# Altium project main_io.PrjPcb (part 1 of 6)
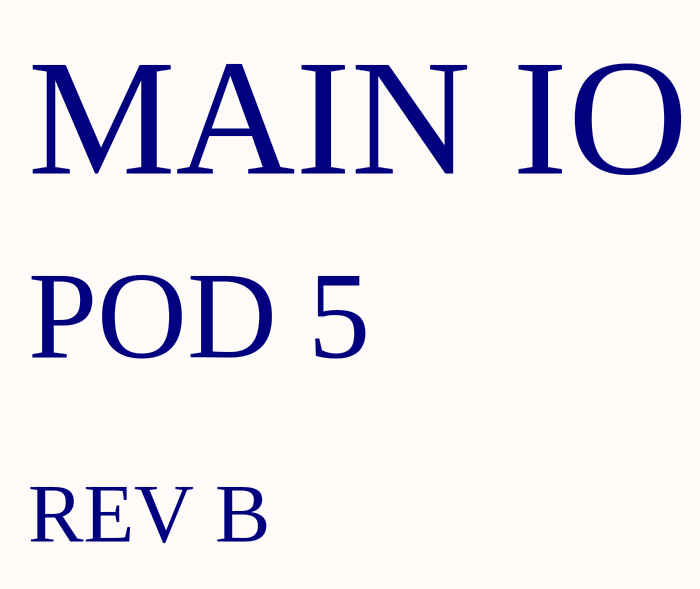
[diagram p0: main_io.SchDoc]
20 sheets, 549 parts. Net scope: global (net labels, ports and power ports of the same name join across sheets).
Board file: main_io.PcbDoc
Sheets:
  main_io.SchDoc
  connectors.SchDoc
  beaglebone.SchDoc
  bus_filter.SchDoc
  power_5V.SchDoc
  power_12V.SchDoc
  can_uart.SchDoc
  retros.SchDoc
  arduino_shield.SchDoc
  bms_interface.SchDoc
  motor_controller_interface.SchDoc
  RTC.SchDoc
  shutdown_circuit.SchDoc
  adc.SchDoc
  battery_interface.SchDoc
  misc_sensors.SchDoc
  batt_protection.SchDoc
  gpio.SchDoc
  limit_switches.SchDoc
  power_28V.SchDoc

## Sheet main_io.SchDoc: Main IO
size A4; Organization: Badgerloop Electrical; Address1: 133 Engineering Research Building; Address2: 1500 Engineering Drive; Address3: Madison, Wi 53706; SheetNumber: 1

### Notes on the sheet
- MAIN IO
- POD 5
- REV B
- Title
- Engineer:
- Date:
- Time:
- Revision:
- Sheet
- of
- File:

## Sheet connectors.SchDoc: Connectors
size A4; Organization: Badgerloop Electrical; Address1: 133 Engineering Research Building; Address2: 1500 Engineering Drive; Address3: Madison, Wi 53706; SheetNumber: 2
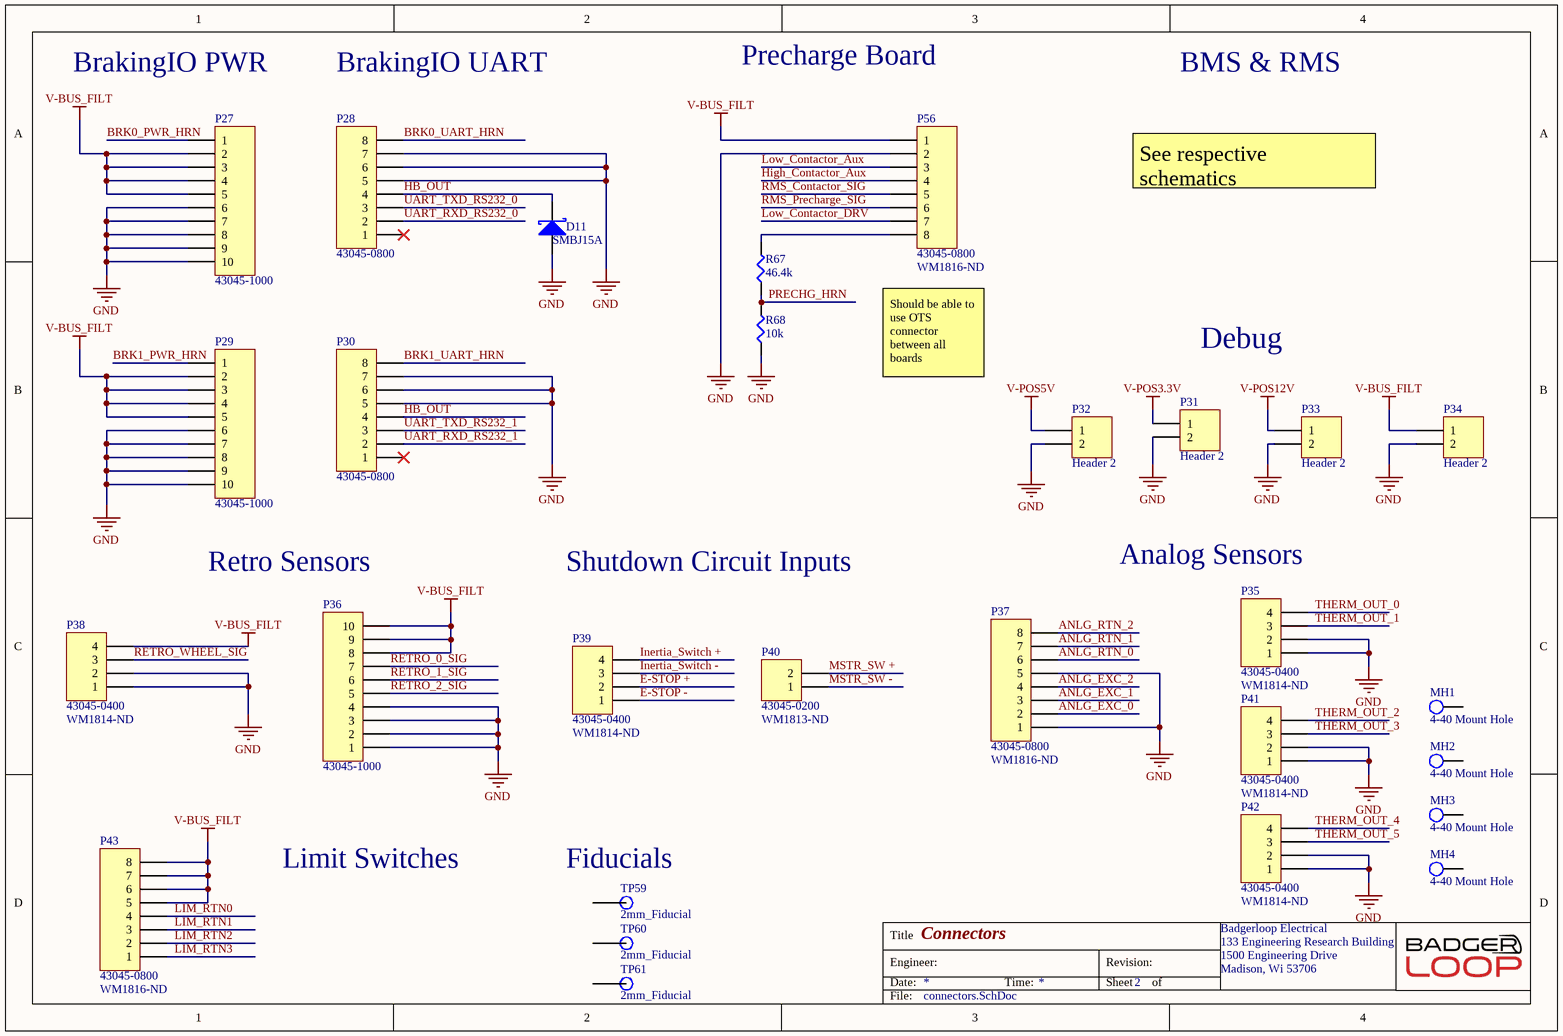
[diagram p1: connectors.SchDoc]

### Parts
D11  SMBJ15A  [DIOM4436X26N]
MH1  4-40 Mount Hole  [MH]
MH2  4-40 Mount Hole  [MH]
MH3  4-40 Mount Hole  [MH]
MH4  4-40 Mount Hole  [MH]
P27  43045-1000  [430451000]
P28  43045-0800  [430450800]
P29  43045-1000  [430451000]
P30  43045-0800  [430450800]
P31  Header 2  [Pin Header 1x2 TH Pitch 2.54mm]
P32  Header 2  [Pin Header 1x2 TH Pitch 2.54mm]
P33  Header 2  [Pin Header 1x2 TH Pitch 2.54mm]
P34  Header 2  [Pin Header 1x2 TH Pitch 2.54mm]
P35  43045-0400  Supplier Part Number 1: WM1814-ND  [430450400]
P36  43045-1000  [430451000]
P37  43045-0800  Supplier Part Number 1: WM1816-ND  [430450800]
P38  43045-0400  Supplier Part Number 1: WM1814-ND  [430450400]
P39  43045-0400  Supplier Part Number 1: WM1814-ND  [430450400]
P40  43045-0200  Supplier Part Number 1: WM1813-ND  [430450200]
P41  43045-0400  Supplier Part Number 1: WM1814-ND  [430450400]
P42  43045-0400  Supplier Part Number 1: WM1814-ND  [430450400]
P43  43045-0800  Supplier Part Number 1: WM1816-ND  [430450800]
P56  43045-0800  Supplier Part Number 1: WM1816-ND  [430450800]
R67  46.4k  [SMD-1206-RES]
R68  10k  [SMD-0805-RES]
TP59  2mm_Fiducial  [2mm_Fiducial]
TP60  2mm_Fiducial  [2mm_Fiducial]
TP61  2mm_Fiducial  [2mm_Fiducial]

### Nets
GND: D11.2(K) P27.6 P27.7 P27.8 P27.9 P27.10 P28.5 P28.6 P28.7 P29.6 P29.7 P29.8 P29.9 P29.10 P30.5 P30.6 P30.7 P31.2 P32.2 P33.2 P34.2 P35.1 P35.2 P36.1 P36.2 P36.3 P36.4 P37.1 P37.5 P38.1 P38.2 P41.1 P41.2 P42.1 P42.2 P56.2 R68.1
MSTR_SW +: P27.2 P27.3 P27.4 P27.5 P29.2 P29.3 P29.4 P29.5 P34.1 P36.8 P36.9 P36.10 P38.4 P40.2 P43.5 P43.6 P43.7 P43.8 P56.1  [also labelled V-BUS_FILT]
V-POS3.3V: P31.1
V-POS5V: P32.1
V-POS12V: P33.1
ANLG_EXC_0: P37.2
ANLG_EXC_1: P37.3
ANLG_EXC_2: P37.4
ANLG_RTN_0: P37.6
ANLG_RTN_1: P37.7
ANLG_RTN_2: P37.8
BRK0_PWR_HRN: P27.1
BRK0_UART_HRN: P28.8
BRK1_PWR_HRN: P29.1
BRK1_UART_HRN: P30.8
E-STOP +: P39.2 P40.1  [also labelled MSTR_SW -]
E-STOP -: P39.1
HB_OUT: D11.1(A) P28.4 P30.4
High_Contactor_Aux: P56.4
Inertia_Switch +: P39.4
Inertia_Switch -: P39.3
LIM_RTN0: P43.4
LIM_RTN1: P43.3
LIM_RTN2: P43.2
LIM_RTN3: P43.1
Low_Contactor_Aux: P56.3
Low_Contactor_DRV: P56.7
PRECHG_HRN: R67.1 R68.2
RETRO_0_SIG: P36.7
RETRO_1_SIG: P36.6
RETRO_2_SIG: P36.5
RETRO_WHEEL_SIG: P38.3
RMS_Contactor_SIG: P56.5
RMS_Precharge_SIG: P56.6
THERM_OUT_0: P35.4
THERM_OUT_1: P35.3
THERM_OUT_2: P41.4
THERM_OUT_3: P41.3
THERM_OUT_4: P42.4
THERM_OUT_5: P42.3
UART_RXD_RS232_0: P28.2
UART_RXD_RS232_1: P30.2
UART_TXD_RS232_0: P28.3
UART_TXD_RS232_1: P30.3
NetP56_8: P56.8 R67.2

Not connected (* = marked no-connect by the designer): MH1 46; MH2 46; MH3 46; MH4 46; P28 1*; P30 1*; TP59 1; TP60 1; TP61 1

### Notes on the sheet
- BrakingIO PWR
- BrakingIO UART
- Precharge Board
- BMS & RMS
- See respective schematics
- Should be able to use OTS connector between all boards
- Debug
- Retro Sensors
- Shutdown Circuit Inputs
- (near P35) Analog Sensors
- Limit Switches
- (near TP59) Fiducials
- Title
- Engineer:
- Date:
- Time:
- Revision:
- Sheet
- of
- File:

### Library data of the parts
D11 = SMBJ15A: TVS DIODE 15V 24.4V DO214AA; Manufacturer: Littelfuse; Direction: Unidirectional; Min Breakdown Voltage: 16.7V; Peak Pulse Power: 600W; Peak Pulse Current: 24.6A; Test Current: 1mA; Number of Elements: 1; Power Line Protection: No; Max Breakdown Voltage: 18.5V; Max Reverse Leakage Current: 1uA; Max Power Dissipation: 5W; Element Configuration: Single; ESD Protection: Yes; Current: 68A; Voltage: 5V; Supplier 1: Digi-Key; Stock 1: 73945; Pricing 1: 1=0.45000, 10=0.33900, 25=0.30520, 100=0.21090, 250=0.17760, 500=0.14430, 1000=0.11100 (USD); RoHS: Yes; Mount: Surface Mount; Case/Package: SMB; Number of Pins: 2; Min Operating Temperature: -65°C; Max Operating Temperature: 150°C; Packaging: Tape and Reel; Reverse Standoff Voltage: 15V; Clamping Voltage: 24.4V; Power Dissipation: 600W; Voltage Rating (DC): 15V; Reverse Breakdown Voltage: 16.7V; Package Quantity: 3000; Operating Supply Voltage: 15V; Max Surge Current: 24.6A; Number of Unidirectional Channels: 1; Breakdown Voltage: 16.7V; Number of Channels: 1; Polarity: Unidirectional; Termination: SMD/SMT; Leakage Current: 1uA; Composition: Zener; Length: 4.57mm; Height: 2.237mm; Width: 3.94mm; Radiation Hardening: No; Lead Free: Lead Free; REACH SVHC: Unknown; ComponentLink1URL: https://datasheet.ciiva.com/34301/1078555-34301957.pdf?src-supplier=Jameco; ComponentLink1Description: https://datasheet.ciiva.com/34301/1078555-34301957.pdf?src-supplier=Jameco; ComponentLink2URL: https://datasheet.ciiva.com/25624/0900766b810f4eeb-25624826.pdf?src-supplier=RSComponents; ComponentLink2Description: https://datasheet.ciiva.com/25624/0900766b810f4eeb-25624826.pdf?src-supplier=RSComponents; ComponentLink3URL: https://datasheet.ciiva.com/46385/13057-46385079.pdf?src-supplier=Element14; ComponentLink3Description: https://datasheet.ciiva.com/46385/13057-46385079.pdf?src-supplier=Element14; ComponentLink4URL: https://datasheet.ciiva.com/331/littelfuse-tvs-diode-smbj-datasheet-pdf-331176.pdf?src-supplier=Digi-Key; ComponentLink4Description: https://datasheet.ciiva.com/331/littelfuse-tvs-diode-smbj-datasheet-pdf-331176.pdf?src-supplier=Digi-Key; ComponentLink5URL: https://datasheet.ciiva.com/331/littelfuse-tvs-diode-smbj-datasheet-pdf-331177.pdf?src-supplier=Digi-Key; ComponentLink5Description: https://datasheet.ciiva.com/331/littelfuse-tvs-diode-smbj-datasheet-pdf-331177.pdf?src-supplier=Digi-Key; ComponentLink6URL: https://datasheet.ciiva.com/331/littelfuse-tvs-diode-smbj-datasheet-pdf-331178.pdf?src-supplier=Digi-Key; ComponentLink6Description: https://datasheet.ciiva.com/331/littelfuse-tvs-diode-smbj-datasheet-pdf-331178.pdf?src-supplier=Digi-Key; Supplier 2: Digi-Key; Stock 2: 69911; Pricing 2: 1=0.35000, 10=0.28700, 25=0.26240, 100=0.19540, 250=0.17704, 500=0.14652, 1000=0.10989 (USD); ComponentLink7URL: https://datasheet.ciiva.com/25624/0900766b810f4eeb-25624712.pdf?src-supplier=RSComponents; ComponentLink7Description: https://datasheet.ciiva.com/25624/0900766b810f4eeb-25624712.pdf?src-supplier=RSComponents; ComponentLink8URL: https://datasheet.ciiva.com/34302/1546929-34302459.pdf?src-supplier=Jameco; ComponentLink8Description: https://datasheet.ciiva.com/34302/1546929-34302459.pdf?src-supplier=Jameco; ComponentLink9URL: https://datasheet.ciiva.com/46381/1677318-46381958.pdf?src-supplier=Element14; ComponentLink9Description: https://datasheet.ciiva.com/46381/1677318-46381958.pdf?src-supplier=Element14; ComponentLink10URL: https://datasheet.ciiva.com/331/littelfuse-tvs-diode-smbj-datasheet-pdf-331131.pdf?src-supplier=Digi-Key; ComponentLink10Description: https://datasheet.ciiva.com/331/littelfuse-tvs-diode-smbj-datasheet-pdf-331131.pdf?src-supplier=Digi-Key; ComponentLink11URL: https://datasheet.ciiva.com/331/littelfuse-tvs-diode-smbj-datasheet-pdf-331132.pdf?src-supplier=Digi-Key; ComponentLink11Description: https://datasheet.ciiva.com/331/littelfuse-tvs-diode-smbj-datasheet-pdf-331132.pdf?src-supplier=Digi-Key; ComponentLink12URL: https://datasheet.ciiva.com/331/littelfuse-tvs-diode-smbj-datasheet-pdf-331133.pdf?src-supplier=Digi-Key; ComponentLink12Description: https://datasheet.ciiva.com/331/littelfuse-tvs-diode-smbj-datasheet-pdf-331133.pdf?src-supplier=Digi-Key; Supplier Part Number 2: SMBJ5.0ALFCT-ND; Supplier Part Number 1: SMBJ15ALFCT-ND
P27 P29 P36 = 43045-1000: GLOVE, POLYAMIDE, L/FREE, PU, SIZE 6 - More Details; Manufacturer: Molex; Connector Type: Power,Rectangular; Number of Positions: 10; Contact Resistance: 10mR; Gender: Male; Current Rating: 5A; Voltage Rating: 250V; Max Voltage Rating (DC): 250.25kV; Insulation Resistance: 1GR; Pitch: 3mm; Approvals: UL,CSA,TUV; Glow Wire Compliant: Compliant; Supplier 1: Digi-Key; Manufacturer Part Number: 43045-1000; Stock 1: 4799; Pricing 1: 1=2.57000, 10=2.33100, 100=1.99790, 500=1.66496, 1000=1.42710, 5000=1.26536 (USD); RoHS: Yes; Mount: Through Hole,PCB; Contact Plating: Tin; Color: Black; Contact Material: Brass,Tin; Housing Color: Black; Housing Material: Thermoplastic; Material: Polyester; Min Operating Temperature: -40°C; Max Operating Temperature: 105°C; Number of Rows: 2; Termination: Solder; Packaging: Tray; Number of Contacts: 10; Package Quantity: 1224; Orientation: Right Angle; Max Current Rating: 5A; Number of Poles: 10; Voltage Rating (AC): 250V; Number of Circuits: 10; Working Voltage: 250V; Voltage Rating (DC): 250V; Diameter: 3mm; Length: 19.15mm; Height: 8.77mm; Row Spacing: 3mm; Depth: 12.2mm; Radiation Hardening: No; Lead Free: Lead Free; Flammability Rating: UL94 V-0; REACH SVHC: Unknown; Halogen Free: Low Halogen; ComponentLink1URL: https://datasheet.ciiva.com/5150/0430451000-pcb-headers-143006-5150145.pdf?src-supplier=Mouser; ComponentLink1Description: https://datasheet.ciiva.com/5150/0430451000-pcb-headers-143006-5150145.pdf?src-supplier=Mouser; ComponentLink2URL: https://datasheet.ciiva.com/11749/0900766b80027348-11749233.pdf?src-supplier=RSComponents; ComponentLink2Description: https://datasheet.ciiva.com/11749/0900766b80027348-11749233.pdf?src-supplier=RSComponents; ComponentLink3URL: https://datasheet.ciiva.com/19461/883595-19461109.pdf?src-supplier=Jameco; ComponentLink3Description: https://datasheet.ciiva.com/19461/883595-19461109.pdf?src-supplier=Jameco; ComponentLink4URL: https://datasheet.ciiva.com/30068/153980430451000-pcb-headers-30068060.pdf?src-supplier=Onlinecomponents.com; ComponentLink4Description: https://datasheet.ciiva.com/30068/153980430451000-pcb-headers-30068060.pdf?src-supplier=Onlinecomponents.com; ComponentLink5URL: https://datasheet.ciiva.com/14155/04402310-14155207.pdf?src-supplier=Distrelec; ComponentLink5Description: https://datasheet.ciiva.com/14155/04402310-14155207.pdf?src-supplier=Distrelec; ComponentLink6URL: https://datasheet.ciiva.com/18454/70090797-18454139.pdf?src-supplier=Allied+Electronics; ComponentLink6Description: https://datasheet.ciiva.com/18454/70090797-18454139.pdf?src-supplier=Allied+Electronics; ComponentLink7URL: https://datasheet.ciiva.com/16658/0430451000-pcb-headers-16658413.pdf?src-supplier=Avnet+Europe; ComponentLink7Description: https://datasheet.ciiva.com/16658/0430451000-pcb-headers-16658413.pdf?src-supplier=Avnet+Europe; ComponentLink8URL: https://datasheet.ciiva.com/9468/0430451000-pcb-headers-9468495.pdf?src-supplier=Avnet; ComponentLink8Description: https://datasheet.ciiva.com/9468/0430451000-pcb-headers-9468495.pdf?src-supplier=Avnet; Supplier Part Number 1: WM1817-ND
P28 P30 P37 P43 P56 = 43045-0800: CONN HEADER R/A 8POS 3MM; Manufacturer: Molex; Number of Contacts: 8; Contact Resistance: 10mR; Max Voltage Rating (DC): 250.25kV; Current Rating: 5A; Voltage Rating (AC): 250V; Voltage Rating: 600V; Gender: Male; Insulation Resistance: 1GR; Approvals: UL,CSA,TUV; Glow Wire Compliant: Compliant; Supplier 1: Digi-Key; Manufacturer Part Number: 43045-0800; Stock 1: 2632; Pricing 1: 1=1.91000, 10=1.73100, 100=1.48390, 500=1.23656, 1000=1.05990, 5000=0.93978, 10000=0.91858 (USD); RoHS: Yes; Mount: Through Hole; Case/Package: SMC; Contact Plating: Tin; Contact Material: Brass,Tin; Color: Black; Housing Color: Black; Housing Material: Thermoplastic; Material: Polyester; Min Operating Temperature: -40°C; Max Operating Temperature: 105°C; Number of Rows: 2; Termination: Solder; Packaging: Tray; Number of Positions: 8; Orientation: Right Angle; Number of Poles: 8; Package Quantity: 1440; Max Current Rating: 5A; Number of Circuits: 8; Working Voltage: 250V; Voltage Rating (DC): 250V; Diameter: 3mm; Length: 16.15mm; Height: 8.77mm; Pitch: 3mm; Row Spacing: 3mm; Depth: 12.2mm; Radiation Hardening: No; Flammability Rating: UL94 V-0; REACH SVHC: Unknown; Halogen Free: Low Halogen; Lead Free: Lead Free; ComponentLink1URL: https://datasheet.ciiva.com/5158/0430450800-pcb-headers-142625-5158817.pdf?src-supplier=Mouser; ComponentLink1Description: https://datasheet.ciiva.com/5158/0430450800-pcb-headers-142625-5158817.pdf?src-supplier=Mouser; ComponentLink2URL: https://datasheet.ciiva.com/7683/27645-7683683.pdf?src-supplier=Element14; ComponentLink2Description: https://datasheet.ciiva.com/7683/27645-7683683.pdf?src-supplier=Element14; ComponentLink3URL: https://datasheet.ciiva.com/19462/883536-19462164.pdf?src-supplier=Jameco; ComponentLink3Description: https://datasheet.ciiva.com/19462/883536-19462164.pdf?src-supplier=Jameco; ComponentLink4URL: https://datasheet.ciiva.com/11751/0900766b80027348-11751142.pdf?src-supplier=RSComponents; ComponentLink4Description: https://datasheet.ciiva.com/11751/0900766b80027348-11751142.pdf?src-supplier=RSComponents; ComponentLink5URL: https://datasheet.ciiva.com/30198/267770430450800-pcb-headers-30198875.pdf?src-supplier=Onlinecomponents.com; ComponentLink5Description: https://datasheet.ciiva.com/30198/267770430450800-pcb-headers-30198875.pdf?src-supplier=Onlinecomponents.com; ComponentLink6URL: https://datasheet.ciiva.com/1443/1850016-1443537.pdf?src-supplier=Element14; ComponentLink6Description: https://datasheet.ciiva.com/1443/1850016-1443537.pdf?src-supplier=Element14; ComponentLink7URL: https://datasheet.ciiva.com/14155/04402310-14155206.pdf?src-supplier=Distrelec; ComponentLink7Description: https://datasheet.ciiva.com/14155/04402310-14155206.pdf?src-supplier=Distrelec; ComponentLink8URL: https://datasheet.ciiva.com/16657/0430450800-pcb-headers-16657964.pdf?src-supplier=Avnet+Europe; ComponentLink8Description: https://datasheet.ciiva.com/16657/0430450800-pcb-headers-16657964.pdf?src-supplier=Avnet+Europe; ComponentLink9URL: https://datasheet.ciiva.com/10087/0430450800-pcb-headers-10087853.pdf?src-supplier=Avnet; ComponentLink9Description: https://datasheet.ciiva.com/10087/0430450800-pcb-headers-10087853.pdf?src-supplier=Avnet
  P28 P30: Supplier Part Number 1: WM1816-ND
P31-P34 = Header 2: Header, 2-Pin; LatestRevisionDate: 17-Jul-2002; LatestRevisionNote: Re-released for DXP Platform.; Publisher: Altium Limited
P35 P38 P39 P41 P42 = 43045-0400: Male connector dual row 90° 3 mm Pole no. 2x2 Micro-Fit, 43045-0400, Molex; Contact Resistance: 10mR; Number of Contacts: 4; Max Voltage Rating (AC): 250V; Connector Type: Male Pin; Pitch: 3mm; Row Spacing: 0.118inch; Supplier 1: Digi-Key; Manufacturer: Molex; Manufacturer Part Number: 43045-0400; Stock 1: 5904; Pricing 1: 1=1.33000, 10=1.16700, 100=1.00670, 500=0.82368, 1000=0.73216, 5000=0.64064, 10000=0.60861 (USD); RoHS: Yes; Mount: Through Hole; Contact Plating: Tin; Color: Black; Contact Material: Brass; Housing Color: Black; Housing Material: Polymer; Min Operating Temperature: -40°C; Max Operating Temperature: 105°C; Number of Rows: 2; Termination: Solder; Packaging: Tray; Fastening Type: Ramp; Number of Positions: 4; Orientation: Right Angle; Length: 10.15mm; Depth: 12.2mm; Flammability Rating: UL94 V-0; ComponentLink1URL: https://datasheet.ciiva.com/712/430450200-sd-712017.pdf?src-supplier=Digi-Key; ComponentLink1Description: https://datasheet.ciiva.com/712/430450200-sd-712017.pdf?src-supplier=Digi-Key; ComponentLink2URL: https://datasheet.ciiva.com/20209/22-3744e-20209522.pdf?src-supplier=Rapid+Electronics; ComponentLink2Description: https://datasheet.ciiva.com/20209/22-3744e-20209522.pdf?src-supplier=Rapid+Electronics; ComponentLink3URL: https://datasheet.ciiva.com/11746/0900766b80027348-11746988.pdf?src-supplier=RSComponents; ComponentLink3Description: https://datasheet.ciiva.com/11746/0900766b80027348-11746988.pdf?src-supplier=RSComponents; ComponentLink4URL: https://datasheet.ciiva.com/30193/145420430450400-pcb-headers-30193310.pdf?src-supplier=Onlinecomponents.com; ComponentLink4Description: https://datasheet.ciiva.com/30193/145420430450400-pcb-headers-30193310.pdf?src-supplier=Onlinecomponents.com
P40 = 43045-0200: CONN HEADER R/A 2POS; Manufacturer: Molex; Contact Resistance: 10mR; Number of Contacts: 2; Voltage Rating: 600V; Current Rating: 5A; Gender: Male; Max Voltage Rating (DC): 250.25kV; Voltage Rating (DC): 250V; Insulation Resistance: 1GR; Pitch: 3mm; Glow Wire Compliant: Compliant; Approvals: UL,CSA,TUV; Supplier 1: Digi-Key; Manufacturer Part Number: 43045-0200; Stock 1: 6320; Pricing 1: 1=0.97000, 10=0.84900, 100=0.73280, 500=0.59958, 1000=0.53296, 5000=0.46634, 10000=0.44302 (USD); RoHS: Yes; Mount: Through Hole; Case/Package: SMC; Contact Plating: Tin; Color: Black; Contact Material: Brass,Tin; Housing Color: Black; Housing Material: Thermoplastic; Material: Thermoplastic; Min Operating Temperature: -40°C; Max Operating Temperature: 105°C; Termination: Through Hole; Number of Rows: 2; Orientation: Right Angle; Packaging: Tray; Number of Positions: 2; Package Quantity: 3168; Number of Circuits: 2; Contact Gender: Male; Diameter: 3mm; Row Spacing: 3mm; Radiation Hardening: No; Flammability Rating: UL94 V-0; REACH SVHC: Unknown; Lead Free: Lead Free; Halogen Free: Low Halogen; ComponentLink1URL: https://datasheet.ciiva.com/14155/04402310-14155203.pdf?src-supplier=Distrelec; ComponentLink1Description: https://datasheet.ciiva.com/14155/04402310-14155203.pdf?src-supplier=Distrelec; ComponentLink2URL: https://datasheet.ciiva.com/19454/883270-19454006.pdf?src-supplier=Jameco; ComponentLink2Description: https://datasheet.ciiva.com/19454/883270-19454006.pdf?src-supplier=Jameco; ComponentLink3URL: https://datasheet.ciiva.com/5150/0430450200-pcb-headers-145770-5150407.pdf?src-supplier=Mouser; ComponentLink3Description: https://datasheet.ciiva.com/5150/0430450200-pcb-headers-145770-5150407.pdf?src-supplier=Mouser; ComponentLink4URL: https://datasheet.ciiva.com/11747/0900766b80027348-11747001.pdf?src-supplier=RSComponents; ComponentLink4Description: https://datasheet.ciiva.com/11747/0900766b80027348-11747001.pdf?src-supplier=RSComponents; ComponentLink5URL: https://datasheet.ciiva.com/16656/0430450200-pcb-headers-16656330.pdf?src-supplier=Avnet+Europe; ComponentLink5Description: https://datasheet.ciiva.com/16656/0430450200-pcb-headers-16656330.pdf?src-supplier=Avnet+Europe; ComponentLink6URL: https://datasheet.ciiva.com/10090/0430450200-pcb-headers-10090299.pdf?src-supplier=Avnet; ComponentLink6Description: https://datasheet.ciiva.com/10090/0430450200-pcb-headers-10090299.pdf?src-supplier=Avnet; ComponentLink7URL: https://datasheet.ciiva.com/36854/124280430450200-pcb-headers-36854331.pdf?src-supplier=Onlinecomponents.com; ComponentLink7Description: https://datasheet.ciiva.com/36854/124280430450200-pcb-headers-36854331.pdf?src-supplier=Onlinecomponents.com; ComponentLink8URL: https://datasheet.ciiva.com/1443/1859921-1443437.pdf?src-supplier=Element14; ComponentLink8Description: https://datasheet.ciiva.com/1443/1859921-1443437.pdf?src-supplier=Element14
R67 = ERJ-8ENF4642V: RES SMD 46.4K OHM 1% 1/4W 1206; Manufacturer: Panasonic Electronic Components; Factory Stock: 0; Unit Price (USD): 0.00933; @ qty: 1500; Minimum Quantity: 1; Power (Watts): 0.25W, 1/4W; Temperature Coefficient: ±100ppm/°C; Part Number: ERJ-8ENF4642V; Datasheets: http://industrial.panasonic.com/www-cgi/jvcr13pz.cgi?E+PZ+3+AOA0002+ERJ8ENF4642V+7+WW; Image: //media.digikey.com/Renders/Panasonic%20Renders/ERJ-1206%20Pkg.jpg; Digi-Key Part Number: P46.4KFCT-ND; Quantity Available: 23527; Packaging: Cut Tape (CT); Series: ERJ; Part Status: Active; Value: 46.4k; Tolerance: ±1%; Composition: Thick Film; Features: Automotive AEC-Q200; Operating Temperature: -55°C ~ 155°C; Package / Case: 1206 (3216 Metric); Supplier Device Package: 1206; Size / Dimension: 0.126" L x 0.063" W (3.20mm x 1.60mm); Height - Seated (Max): 0.028" (0.70mm); Number of Terminations: 2; Failure Rate: -
R68 = ERJ-P06J103V: RES SMD 10K OHM 5% 1/2W 0805; Manufacturer: Panasonic Electronic Components; Factory Stock: 0; Unit Price (USD): 0.01839; @ qty: 1500; Minimum Quantity: 1; Power (Watts): 0.5W, 1/2W; Temperature Coefficient: ±200ppm/°C; Part Number: ERJ-P06J103V; Datasheets: https://industrial.panasonic.com/cdbs/www-data/pdf/RDA0000/AOA0000C243.pdf; Image: //media.digikey.com/Renders/Panasonic%20Renders/ERJ-0805%20Pkg.jpg; Digi-Key Part Number: P10KADCT-ND; Quantity Available: 413576; Packaging: Cut Tape (CT); Series: ERJ; Part Status: Active; Value: 10k; Tolerance: ±5%; Composition: Thick Film; Features: Automotive AEC-Q200, Pulse Withstanding; Operating Temperature: -55°C ~ 155°C; Package / Case: 0805 (2012 Metric); Supplier Device Package: 0805; Size / Dimension: 0.079" L x 0.049" W (2.00mm x 1.25mm); Height - Seated (Max): 0.028" (0.70mm); Number of Terminations: 2; Failure Rate: -
TP59-TP61 = 2mm_Fiducial: Fiducial 2mm

## Sheet beaglebone.SchDoc: Beaglebone
size A4; Organization: Badgerloop Electrical; Address1: 133 Engineering Research Building; Address2: 1500 Engineering Drive; Address3: Madison, Wi 53706; SheetNumber: 3
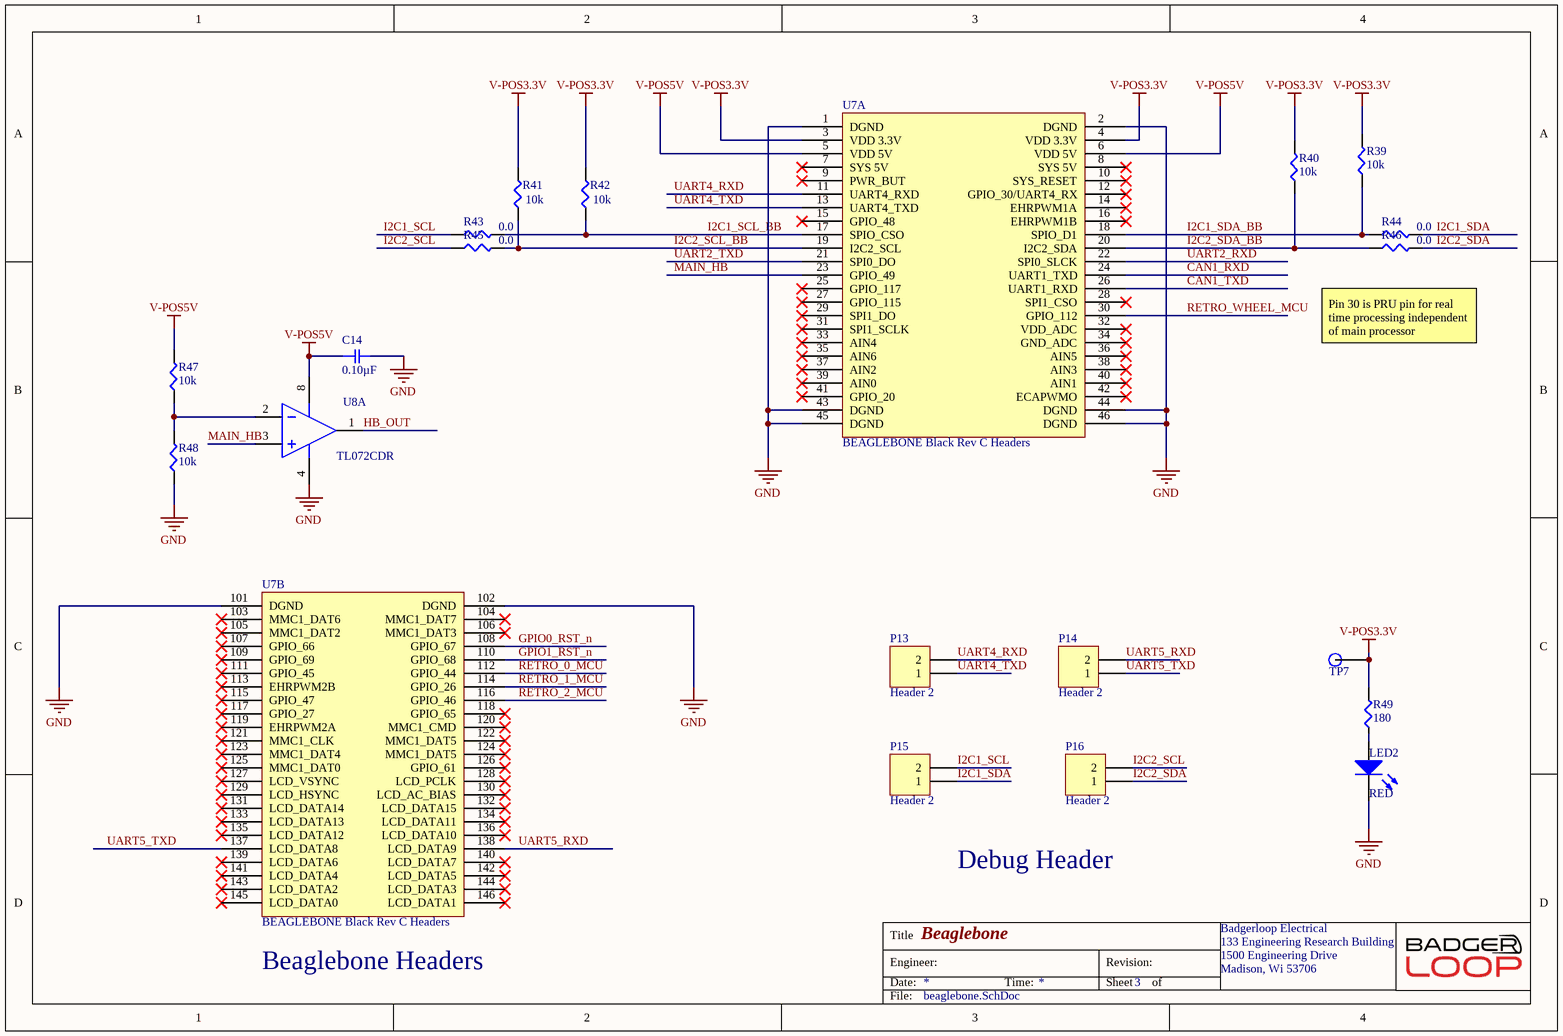
[diagram p2: beaglebone.SchDoc]

### Parts
C14  0.10µF  [SMD-0805C]
LED2  RED  [LED 0603 RED]
P13  Header 2  [Pin Header 1x2 TH Pitch 2.54mm]
P14  Header 2  [Pin Header 1x2 TH Pitch 2.54mm]
P15  Header 2  [Pin Header 1x2 TH Pitch 2.54mm]
P16  Header 2  [Pin Header 1x2 TH Pitch 2.54mm]
R39  10k  [SMD-0805-RES]
R40  10k  [SMD-0805-RES]
R41  10k  [SMD-0805-RES]
R42  10k  [SMD-0805-RES]
R43  0.0  [SMD-1206-RES]
R44  0.0  [SMD-1206-RES]
R45  0.0  [SMD-1206-RES]
R46  0.0  [SMD-1206-RES]
R47  10k  [SMD-0805-RES]
R48  10k  [SMD-0805-RES]
R49  180  [SMD-0805-RES]
TP7  TP  [Test Point]  (value not drawn)
U7  BEAGLEBONE Black Rev C Headers  [Beaglebone_Topside]  (parts A,B of 2)
U8  TL072CDR  [SOP127P600X175-8N]  (part A of 2)

### Nets
GND: C14.2 LED2.2(K) R48.1 U7.1(DGND) U7.2(DGND) U7.43(DGND) U7.44(DGND) U7.45(DGND) U7.46(DGND) U7.101(DGND) U7.102(DGND) U8.4(V-)
V-POS3.3V: R39.2 R40.2 R41.2 R42.2 R49.2 TP7.1 U7.3(VDD_3.3V) U7.4(VDD_3.3V)
V-POS5V: C14.1 R47.2 U7.5(VDD_5V) U7.6(VDD_5V) U8.8(V+)
CAN1_RXD: U7.24(UART1_TXD)
CAN1_TXD: U7.26(UART1_RXD)
GPIO0_RST_n: U7.108(GPIO_67)
GPIO1_RST_n: U7.110(GPIO_68)
HB_OUT: U8.1(OUT)
I2C1_SCL: P15.2 R43.1
I2C1_SCL_BB: R42.1 R43.2 U7.17(SPIO_CSO)
I2C1_SDA: P15.1 R44.2
I2C1_SDA_BB: R39.1 R44.1 U7.18(SPIO_D1)
I2C2_SCL: P16.2 R45.1
I2C2_SCL_BB: R41.1 R45.2 U7.19(I2C2_SCL)
I2C2_SDA: P16.1 R46.2
I2C2_SDA_BB: R40.1 R46.1 U7.20(I2C2_SDA)
MAIN_HB: U7.23(GPIO_49) U8.3(IN+)
RETRO_0_MCU: U7.112(GPIO_44)
RETRO_1_MCU: U7.114(GPIO_26)
RETRO_2_MCU: U7.116(GPIO_46)
RETRO_WHEEL_MCU: U7.30(GPIO_112)
UART2_RXD: U7.22(SPI0_SLCK)
UART2_TXD: U7.21(SPI0_DO)
UART4_RXD: P13.2 U7.11(UART4_RXD)
UART4_TXD: P13.1 U7.13(UART4_TXD)
UART5_RXD: P14.2 U7.138(LCD_DATA9)
UART5_TXD: P14.1 U7.137(LCD_DATA8)
NetLED2_1: LED2.1(A) R49.1
NetR47_1: R47.1 R48.2 U8.2(IN-)

Not connected (* = marked no-connect by the designer): U7 7(SYS_5V)* 8(SYS_5V)* 9(PWR_BUT)* 10(SYS_RESET)* 12(GPIO_30/UART4_RX)* 14(EHRPWM1A)* 15(GPIO_48)* 16(EHRPWM1B)* 25(GPIO_117)* 27(GPIO_115)* 28(SPI1_CSO)* 29(SPI1_DO)* 31(SPI1_SCLK)* 32(VDD_ADC)* 33(AIN4)* 34(GND_ADC)* 35(AIN6)* 36(AIN5)* 37(AIN2)* 38(AIN3)* 39(AIN0)* 40(AIN1)* 41(GPIO_20)* 42(ECAPWMO)* 103(MMC1_DAT6)* 104(MMC1_DAT7)* 105(MMC1_DAT2)* 106(MMC1_DAT3)* 107(GPIO_66)* 109(GPIO_69)* 111(GPIO_45)* 113(EHRPWM2B)* 115(GPIO_47)* 117(GPIO_27)* 118(GPIO_65)* 119(EHRPWM2A)* 120(MMC1_CMD)* 121(MMC1_CLK)* 122(MMC1_DAT5)* 123(MMC1_DAT4)* 124(MMC1_DAT5)* 125(MMC1_DAT0)* 126(GPIO_61)* 127(LCD_VSYNC)* 128(LCD_PCLK)* 129(LCD_HSYNC)* 130(LCD_AC_BIAS)* 131(LCD_DATA14)* 132(LCD_DATA15)* 133(LCD_DATA13)* 134(LCD_DATA11)* 135(LCD_DATA12)* 136(LCD_DATA10)* 139(LCD_DATA6)* 140(LCD_DATA7)* 141(LCD_DATA4)* 142(LCD_DATA5)* 143(LCD_DATA2)* 144(LCD_DATA3)* 145(LCD_DATA0)* 146(LCD_DATA1)*

### Notes on the sheet
- Pin 30 is PRU pin for real time processing independent of main processor
- Debug Header
- (near U7) Beaglebone Headers
- Title
- Engineer:
- Date:
- Time:
- Revision:
- Sheet
- of
- File:

### Library data of the parts
C14 = GRM21B7U1A104JA01L: CAP CER 0.1UF 10V U2J 0805; Manufacturer: Murata Electronics North America; Factory Stock: 0; Unit Price (USD): 0.4; Minimum Quantity: 1; Tolerance: ±5%; Datasheets: http://www.murata.com/~/media/webrenewal/support/library/catalog/products/capacitor/mlcc/c02e.pdf; Image: //media.digikey.com/Renders/Murata%20Renders/0805%20(2012%20Metric)%20.85mm.jpg; Digi-Key Part Number: 490-11592-1-ND; Part Number: GRM21B7U1A104JA01L; Quantity Available: 3390; @ qty: 0; Packaging: Cut Tape (CT); Series: GRM; Part Status: Active; Value: 0.10µF; Voltage: 10V; Temperature Coefficient: U2J; Operating Temperature: -55°C ~ 125°C; Features: -; Ratings: -; Applications: General Purpose; Mounting Type: Surface Mount, MLCC; Package / Case: 0805 (2012 Metric); Size / Dimension: 0.079" L x 0.049" W (2.00mm x 1.25mm); Height - Seated (Max): -; Thickness (Max): 0.053" (1.35mm); Lead Spacing: -; Lead Style: -
LED2 = LED RED 0603: Red 631nm LED Indication - Discrete 2V 0603 (1608 Metric); Manufacturer: Lite-On Inc.; Manufacturer P/N: LTST-C190KRKT; Digikey P/N: 160-1436-1-ND; Package / Case: 0603; Color: RED
P13-P16 = Header 2: Header, 2-Pin; LatestRevisionDate: 17-Jul-2002; LatestRevisionNote: Re-released for DXP Platform.; Publisher: Altium Limited
R39-R42 = ERJ-6GEYJ103V: RES SMD 10K OHM 5% 1/8W 0805; Manufacturer: Panasonic Electronic Components; Factory Stock: 0; Unit Price (USD): 0.00496; @ qty: 1500; Minimum Quantity: 1; Power (Watts): 0.125W, 1/8W; Temperature Coefficient: ±200ppm/°C; Part Number: ERJ-6GEYJ103V; Datasheets: http://industrial.panasonic.com/www-cgi/jvcr13pz.cgi?E+PZ+3+AOA0001+ERJ6GEYJ103V+7+WW; Image: //media.digikey.com/Renders/Panasonic%20Renders/ERJ-0805%20Pkg.jpg; Digi-Key Part Number: P10KACT-ND; Quantity Available: 2328224; Packaging: Cut Tape (CT); Series: ERJ; Part Status: Active; Value: 10k; Tolerance: ±5%; Composition: Thick Film; Features: Automotive AEC-Q200; Operating Temperature: -55°C ~ 155°C; Package / Case: 0805 (2012 Metric); Supplier Device Package: 0805; Size / Dimension: 0.079" L x 0.049" W (2.00mm x 1.25mm); Height - Seated (Max): 0.028" (0.70mm); Number of Terminations: 2; Failure Rate: -
R43-R46 = ERJ-8GEY0R00V: RES SMD 0.0 OHM JUMPER 1/4W 1206; Manufacturer: Panasonic Electronic Components; Factory Stock: 0; Unit Price (USD): 0.00768; @ qty: 1500; Minimum Quantity: 1; Power (Watts): 0.25W, 1/4W; Part Number: ERJ-8GEY0R00V; Datasheets: http://industrial.panasonic.com/www-cgi/jvcr13pz.cgi?E+PZ+3+AOA0001+ERJ8GEY0R00V+7+WW; Image: //media.digikey.com/Renders/Panasonic%20Renders/ERJ-1206%20Pkg.jpg; Digi-Key Part Number: P0.0ECT-ND; Quantity Available: 1074190; Packaging: Cut Tape (CT); Series: ERJ; Part Status: Active; Value: 0.0; Tolerance: Jumper; Composition: Thick Film; Features: Automotive AEC-Q200; Temperature Coefficient: -; Operating Temperature: -55°C ~ 155°C; Package / Case: 1206 (3216 Metric); Supplier Device Package: 1206; Size / Dimension: 0.126" L x 0.063" W (3.20mm x 1.60mm); Height - Seated (Max): 0.028" (0.70mm); Number of Terminations: 2; Failure Rate: -
R47 R48 = ERJ-P06J103V: as R68 on sheet connectors; Part Number: ERJ-P06J103V; Datasheets: https://industrial.panasonic.com/cdbs/www-data/pdf/RDA0000/AOA0000C243.pdf; Image: //media.digikey.com/Renders/Panasonic%20Renders/ERJ-0805%20Pkg.jpg; Digi-Key Part Number: P10KADCT-ND; Quantity Available: 413576; Packaging: Cut Tape (CT); Series: ERJ; Part Status: Active; Value: 10k; Tolerance: ±5%; Composition: Thick Film; Features: Automotive AEC-Q200, Pulse Withstanding; Operating Temperature: -55°C ~ 155°C; Package / Case: 0805 (2012 Metric); Supplier Device Package: 0805; Size / Dimension: 0.079" L x 0.049" W (2.00mm x 1.25mm); Height - Seated (Max): 0.028" (0.70mm); Number of Terminations: 2; Failure Rate: -
R49 = ERJ-6ENF1800V: RES SMD 180 OHM 1% 1/8W 0805; Manufacturer: Panasonic Electronic Components; Factory Stock: 0; Unit Price (USD): 0.00729; @ qty: 1500; Minimum Quantity: 1; Power (Watts): 0.125W, 1/8W; Temperature Coefficient: ±100ppm/°C; Part Number: ERJ-6ENF1800V; Datasheets: http://industrial.panasonic.com/www-cgi/jvcr13pz.cgi?E+PZ+3+AOA0002+ERJ6ENF1800V+7+WW; Image: //media.digikey.com/Renders/Panasonic%20Renders/ERJ-0805%20Pkg.jpg; Digi-Key Part Number: P180CCT-ND; Quantity Available: 33231; Packaging: Cut Tape (CT); Series: ERJ; Part Status: Active; Value: 180; Tolerance: ±1%; Composition: Thick Film; Features: Automotive AEC-Q200; Operating Temperature: -55°C ~ 155°C; Package / Case: 0805 (2012 Metric); Supplier Device Package: 0805; Size / Dimension: 0.079" L x 0.049" W (2.00mm x 1.25mm); Height - Seated (Max): 0.028" (0.70mm); Number of Terminations: 2; Failure Rate: -
TP7 = TP: SMD TEST POINT
U7 = Beaglebone: KIT DEV BEAGLEBONE BLACK REV C. Header Breakout; Manufactuer: Beaglebone; Manufacturer P/N: Beaglebone Black REV C; Digikey P/N: BBB01-SC-505-ND; Digikey Link: https://www.digikey.com/product-detail/en/ghi-electronics-llc/BBB01-SC-505/BBB01-SC-505-ND/6210999; Datasheet: https://media.digikey.com/pdf/Data%20Sheets/Circuitco%20Elect/BB-BBLK-000%20Manual.pdf; ComponentLink1Description: Digikey; ComponentLink1URL: https://www.digikey.com/product-detail/en/ghi-electronics-llc/BBB01-SC-505/BBB01-SC-505-ND/6210999
U8 = TL072CDR: IC OPAMP JFET 3MHZ 8SOIC; Manufacturer: Texas Instruments; Voltage Gain: 106.02dB; Min Dual Supply Voltage: 3.5V; Max Dual Supply Voltage: 18V; Nominal Supply Current: 5mA; Common Mode Rejection Ratio: 70dB; Number of Channels: 2; Slew Rate: 13V/µs; Max I/O Voltage: 10mV; Input Bias Current: 200pA; Operating Supply Current: 1.4mA; Dual Supply Voltage: 9V; Supplier 1: Digi-Key; Stock 1: 21821; Pricing 1: 1=0.41, 10=0.334, 100=0.2059, 500=0.1562, 1000=0.11715 (USD); Case/Package: D; Number of Pins: 8; Contact Plating: Gold; Min Operating Temperature: -40°C; Max Operating Temperature: 85°C; Package Quantity: 1; Packaging: Tape and Reel; Unity Gain Bandwidth Product: 3MHz; Bandwidth: 3MHz; Nominal Gain Bandwidth Product: 3MHz; Number of Circuits: 2; Gain Bandwidth Product: 3MHz; Input Offset Voltage (Vos): 10mV; Number of Elements: 2; Max Supply Voltage: 18V; Number of Amplifiers: 2; Length: 4.9mm; Height: 1.58mm; Width: 3.91mm; Radiation Hardening: No; Lead Free: Lead Free; REACH SVHC: No SVHC; ComponentLink1URL: http://www.ti.com/lit/ds/symlink/tl071a.pdf?src-supplier=Digi-Key; ComponentLink1Description: http://www.ti.com/lit/ds/symlink/tl071a.pdf?src-supplier=Digi-Key; ComponentLink2URL: http://www.ti.com/general/docs/lit/getliterature.tsp?genericPartNumber=TL072&&fileType=pdf&src-supplier=Avnet; ComponentLink2Description: http://www.ti.com/general/docs/lit/getliterature.tsp?genericPartNumber=TL072&&fileType=pdf&src-supplier=Avnet; ComponentLink3URL: http://www.farnell.com/datasheets/1882732.pdf?src-supplier=Element14; ComponentLink3Description: http://www.farnell.com/datasheets/1882732.pdf?src-supplier=Element14; Supplier Part Number 1: 296-1282-6-ND

## Sheet bus_filter.SchDoc: Bus Filter
size A4; Organization: Badgerloop Electrical; Address1: 133 Engineering Research Building; Address2: 1500 Engineering Drive; Address3: Madison, Wi 53706; SheetNumber: 4
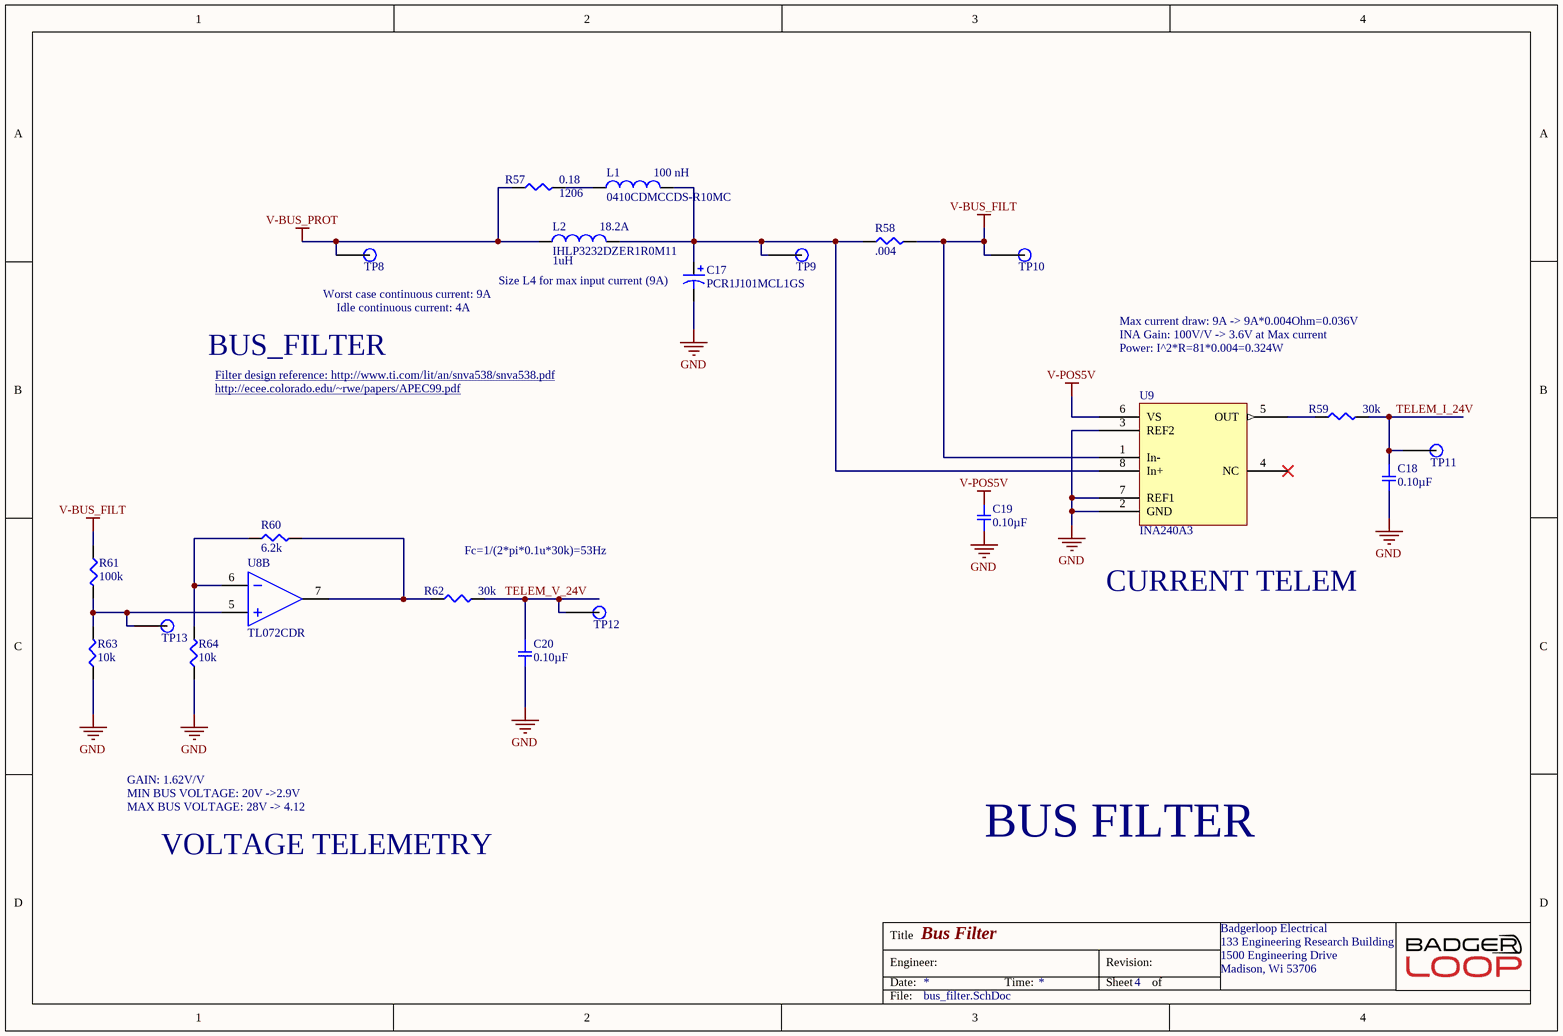
[diagram p3: bus_filter.SchDoc]

### Parts
C17  PCR1J101MCL1GS  [CAPAE110103X126M]
C18  0.10µF  [SMD-0805C]
C19  0.10µF  [SMD-0805C]
C20  0.10µF  [SMD-0805C]
L1  0410CDMCCDS-R10MC  Inductance: 100 nH  [INDM4442X20N]
L2  IHLP3232DZER1R0M11  Current Rating: 18.2A  Inductance: 1uH  [INDM8682X40N]
R57  0.18  Supplier Device Package: 1206  [SMD-1206-RES]
R58  .004  [SMD-1206-RES]
R59  30k  [SMD-0805-RES]
R60  6.2k  [SMD-0805-RES]
R61  100k  [SMD-0805-RES]
R62  30k  [SMD-0805-RES]
R63  10k  [SMD-0805-RES]
R64  10k  [SMD-0805-RES]
TP8  TP  [Test Point]  (value not drawn)
TP9  TP  [Test Point]  (value not drawn)
TP10  TP  [Test Point]  (value not drawn)
TP11  TP  [Test Point]  (value not drawn)
TP12  TP  [Test Point]  (value not drawn)
TP13  TP  [Test Point]  (value not drawn)
U8  TL072CDR  [SOP127P600X175-8N]  (part B of 2)
U9  INA240A3  [SOIC127P600X175-8N]

### Nets
GND: C17.2 C18.2 C19.1 C20.2 R63.1 R64.1 U9.2(GND) U9.3(REF2) U9.7(REF1)
V-BUS_FILT: R58.2 R61.1 TP10.1 U9.1(In-)  [project net MSTR_SW +]
V-BUS_PROT: L2.1 R57.1 TP8.1
V-POS5V: C19.2 U9.6(VS)
TELEM_I_24V: C18.1 R59.2 TP11.1
TELEM_V_24V: C20.1 R62.2 TP12.1
NetC17_1: C17.1 L1.2 L2.2 R58.1 TP9.1 U9.8(In+)
NetL1_1: L1.1 R57.2
NetR59_1: R59.1 U9.5(OUT)
NetR60_1: R60.1 R64.2 U8.6(IN-)
NetR60_2: R60.2 R62.1 U8.7(OUT)
NetR61_2: R61.2 R63.2 TP13.1 U8.5(IN+)

Not connected (* = marked no-connect by the designer): U9 4(NC)*

### Notes on the sheet
- (near TP8) Worst case continuous current: 9A
- (near TP8) Idle continuous current: 4A
- (near C17) Size L4 for max input current (9A)
- BUS_FILTER
- Filter design reference: http://www.ti.com/lit/an/snva538/snva538.pdf <http://www.ti.com/lit/an/snva538/snva538.pdf>
- Max current draw: 9A -> 9A*0.004Ohm=0.036V
- INA Gain: 100V/V -> 3.6V at Max current
- Power: I^2*R=81*0.004=0.324W
- http://ecee.colorado.edu/~rwe/papers/APEC99.pdf
- Fc=1/(2*pi*0.1u*30k)=53Hz
- CURRENT TELEM
- GAIN: 1.62V/V
- MIN BUS VOLTAGE: 20V ->2.9V
- MAX BUS VOLTAGE: 28V -> 4.12
- BUS FILTER
- VOLTAGE TELEMETRY
- Title
- Engineer:
- Date:
- Time:
- Revision:
- Sheet
- of
- File:

### Library data of the parts
C17 = PCR1J101MCL1GS: CAP ALUM POLY 100UF 20% 63V SMD; Manufacturer: Nichicon; ESR (Equivalent Series Resistance): 24mR; Ripple Current: 3A; Leakage Current: 3uA; Life (Hours): 4000Hour; Dissipation Factor: 0.08%; Supplier 1: Digi-Key; Manufacturer Part Number: PCR1J101MCL1GS; Stock 1: 11476; Pricing 1: 1=3.63000, 10=2.92800, 100=2.28380 (USD); RoHS: Yes; Mount: Surface Mount,PCB; Case/Package: Radial; Weight: 0.045856oz; Min Operating Temperature: -55°C; Max Operating Temperature: 125°C; Capacitance: 100uF; Tolerance: 20%; Voltage Rating (DC): 63V; Package Quantity: 1; Packaging: Tape and Reel; Voltage Rating: 63V; Termination: SMD/SMT; Voltage: 63V; Diameter: 10mm; Length: 12.7mm; Height: 12.7mm; Height - Seated (Max): 0.504inch; Depth: 10.3mm; Lead Pitch: 4.6mm; Lead Free: Lead Free; ComponentLink1URL: https://datasheet.ciiva.com/29551/e-ch-ta-29551389.pdf?src-supplier=Digi-Key; ComponentLink1Description: https://datasheet.ciiva.com/29551/e-ch-ta-29551389.pdf?src-supplier=Digi-Key; ComponentLink2URL: https://datasheet.ciiva.com/29551/e-ch-ta-29551390.pdf?src-supplier=Digi-Key; ComponentLink2Description: https://datasheet.ciiva.com/29551/e-ch-ta-29551390.pdf?src-supplier=Digi-Key; ComponentLink3URL: https://datasheet.ciiva.com/29551/e-ch-ta-29551391.pdf?src-supplier=Digi-Key; ComponentLink3Description: https://datasheet.ciiva.com/29551/e-ch-ta-29551391.pdf?src-supplier=Digi-Key; Supplier Part Number 1: 493-13783-1-ND
C18 C20 = GRM219R71C104KA01D: CAP CER 0.1UF 16V X7R 0805; Manufacturer: Murata Electronics North America; Factory Stock: 0; Unit Price (USD): 0.13; Minimum Quantity: 1; Tolerance: ±10%; Datasheets: http://www.murata.com/~/media/webrenewal/support/library/catalog/products/capacitor/mlcc/c02e.pdf; Image: //media.digikey.com/Renders/Murata%20Renders/0805%20(2012%20Metric)%20.85mm.jpg; Digi-Key Part Number: 490-1683-1-ND; Part Number: GRM219R71C104KA01D; Quantity Available: 265464; @ qty: 0; Packaging: Cut Tape (CT); Series: GRM; Part Status: Active; Value: 0.10µF; Voltage: 16V; Temperature Coefficient: X7R; Operating Temperature: -55°C ~ 125°C; Features: -; Ratings: -; Applications: General Purpose; Mounting Type: Surface Mount, MLCC; Package / Case: 0805 (2012 Metric); Size / Dimension: 0.079" L x 0.049" W (2.00mm x 1.25mm); Height - Seated (Max): -; Thickness (Max): 0.037" (0.95mm); Lead Spacing: -; Lead Style: -
C19 = GRM21B7U1A104JA01L: as C14 on sheet beaglebone; Datasheets: http://www.murata.com/~/media/webrenewal/support/library/catalog/products/capacitor/mlcc/c02e.pdf; Image: //media.digikey.com/Renders/Murata%20Renders/0805%20(2012%20Metric)%20.85mm.jpg; Digi-Key Part Number: 490-11592-1-ND; Part Number: GRM21B7U1A104JA01L; Quantity Available: 3390; @ qty: 0; Packaging: Cut Tape (CT); Series: GRM; Part Status: Active; Value: 0.10µF; Voltage: 10V; Temperature Coefficient: U2J; Operating Temperature: -55°C ~ 125°C; Features: -; Ratings: -; Applications: General Purpose; Mounting Type: Surface Mount, MLCC; Package / Case: 0805 (2012 Metric); Size / Dimension: 0.079" L x 0.049" W (2.00mm x 1.25mm); Height - Seated (Max): -; Thickness (Max): 0.053" (1.35mm); Lead Spacing: -; Lead Style: -
L1 = 0410CDMCCDS-R10MC: Ind Chip Power Metal Compound 0.1uH 20% 2-Pin SMD T/R; Manufacturer: Sumida; Saturation Current: 8.2 A; Supplier 1: Digi-Key; Stock 1: 5971; Pricing 1: 1=0.93, 10=0.817, 100=0.5836, 500=0.49024, 1000=0.39687 (USD); ComponentLink1URL: https://products.sumida.com/products/pdf/0410CDMCCDS%20(en).pdf?src-supplier=Digi-Key; ComponentLink1Description: https://products.sumida.com/products/pdf/0410CDMCCDS%20(en).pdf?src-supplier=Digi-Key; Supplier Part Number 1: 308-2523-6-ND
L2 = IHLP3232DZER1R0M11: Fixed Inductors 1uH 20% Low Profile; Manufacturer: Vishay Dale; Core Material: Metal,Composite,Ferrite; Saturation Current: 12A; Shielding: Shielded; Self Resonant Frequency: 49MHz; DC Resistance (DCR): 4.63mR; Test Frequency: 100kHz; Supplier 1: Digi-Key; Stock 1: 9463; Pricing 1: 1=1.61000, 10=1.49500, 100=1.08100 (USD); RoHS: Yes; Mount: Surface Mount; Case/Package: 3232; Number of Pins: 2; Min Operating Temperature: -55°C; Max Operating Temperature: 125°C; Inductance Tolerance: 20%; Packaging: Tape and Reel; Tolerance: 20%; Package Quantity: 500; Max DC Current: 18.2A; Termination: SMD/SMT; RMS Current (Irms): 18.2A; Military Standard: Not; Length: 8.64mm; Height: 4mm; Width: 0.322inch; Height - Seated (Max): 0.157inch; Depth: 8.94mm; Radiation Hardening: No; REACH SVHC: Unknown; Lead Free: Lead Free; ComponentLink1URL: https://datasheet.ciiva.com/6692/ihlp-3232dz-11-6692199.pdf?src-supplier=Digi-Key; ComponentLink1Description: https://datasheet.ciiva.com/6692/ihlp-3232dz-11-6692199.pdf?src-supplier=Digi-Key; ComponentLink2URL: https://datasheet.ciiva.com/6692/ihlp-3232dz-11-6692200.pdf?src-supplier=Digi-Key; ComponentLink2Description: https://datasheet.ciiva.com/6692/ihlp-3232dz-11-6692200.pdf?src-supplier=Digi-Key; ComponentLink3URL: https://datasheet.ciiva.com/6692/ihlp-3232dz-11-6692201.pdf?src-supplier=Digi-Key; ComponentLink3Description: https://datasheet.ciiva.com/6692/ihlp-3232dz-11-6692201.pdf?src-supplier=Digi-Key; ComponentLink4URL: https://datasheet.ciiva.com/17113/70231623-17113262.pdf?src-supplier=Allied+Electronics; ComponentLink4Description: https://datasheet.ciiva.com/17113/70231623-17113262.pdf?src-supplier=Allied+Electronics; Supplier Part Number 1: 541-1348-1-ND
R57 = ERJ-8BSFR18V: RES SMD 0.18 OHM 1% 1/2W 1206; Manufacturer: Panasonic Electronic Components; Factory Stock: 0; Unit Price (USD): 0.11739; @ qty: 1500; Minimum Quantity: 1; Power (Watts): 0.5W, 1/2W; Temperature Coefficient: ±250ppm/°C; Part Number: ERJ-8BSFR18V; Datasheets: https://industrial.panasonic.com/cdbs/www-data/pdf/RDA0000/AOA0000C239.pdf; Image: //media.digikey.com/Renders/Panasonic%20Renders/ERJ-1206%20Pkg.jpg; Digi-Key Part Number: P17683CT-ND; Quantity Available: 1772; Packaging: Cut Tape (CT); Series: ERJ; Part Status: Active; Value: 0.18; Tolerance: ±1%; Composition: Thick Film; Features: Automotive AEC-Q200, Current Sense; Operating Temperature: -55°C ~ 125°C; Package / Case: 1206 (3216 Metric); Size / Dimension: 0.126" L x 0.063" W (3.20mm x 1.60mm); Height - Seated (Max): 0.028" (0.70mm); Number of Terminations: 2; Failure Rate: -
R58 = PMR18EZPFV4L00: RES SMD 0.004 OHM 1% 1W 1206; Manufacturer: Rohm; Resistance: 4mR; Temperature Coefficient: 100ppm/°C; Supplier 1: Digi-Key; Manufacturer Part Number: PMR18EZPFV4L00; Stock 1: 28741; Pricing 1: 1=0.73, 10=0.54, 25=0.4384, 50=0.3812, 100=0.3144, 250=0.27316, 500=0.22234, 1000=0.17635 (USD); Case/Package: 1206; Case Code (Metric): 3216; Case Code (Imperial): 1206; Min Operating Temperature: -55°C; Max Operating Temperature: 155°C; Package Quantity: 1; Tolerance: 1%; Packaging: Tape and Reel; Composition: Thick Film; Number of Terminations: 2; Max Power Dissipation: 1W; Features: Automotive AEC-Q200; Length: 0.126inch; Height: 0.022inch; Width: 0.063inch; Lead Free: Lead Free; ComponentLink1URL: http://www.rohm.com/web/global/datasheet/PMR18EZPFV/pmr-e?src-supplier=Digi-Key; ComponentLink1Description: http://www.rohm.com/web/global/datasheet/PMR18EZPFV/pmr-e?src-supplier=Digi-Key; ComponentLink2URL: https://www.rohm.com/datasheet/PMR18EZPFV/pmr-e?src-supplier=Digi-Key; ComponentLink2Description: https://www.rohm.com/datasheet/PMR18EZPFV/pmr-e?src-supplier=Digi-Key
R59 R62 = ERJ-6ENF3002V: RES SMD 30K OHM 1% 1/8W 0805; Manufacturer: Panasonic Electronic Components; Factory Stock: 0; Unit Price (USD): 0.00729; @ qty: 1500; Minimum Quantity: 1; Power (Watts): 0.125W, 1/8W; Temperature Coefficient: ±100ppm/°C; Part Number: ERJ-6ENF3002V; Datasheets: http://industrial.panasonic.com/www-cgi/jvcr13pz.cgi?E+PZ+3+AOA0002+ERJ6ENF3002V+7+WW; Image: //media.digikey.com/Renders/Panasonic%20Renders/ERJ-0805%20Pkg.jpg; Digi-Key Part Number: P30.0KCCT-ND; Quantity Available: 88046; Packaging: Cut Tape (CT); Series: ERJ; Part Status: Active; Value: 30k; Tolerance: ±1%; Composition: Thick Film; Features: Automotive AEC-Q200; Operating Temperature: -55°C ~ 155°C; Package / Case: 0805 (2012 Metric); Supplier Device Package: 0805; Size / Dimension: 0.079" L x 0.049" W (2.00mm x 1.25mm); Height - Seated (Max): 0.028" (0.70mm); Number of Terminations: 2; Failure Rate: -
R60 = ERJ-P06J622V: RES SMD 6.2K OHM 5% 1/2W 0805; Manufacturer: Panasonic Electronic Components; Factory Stock: 0; Unit Price (USD): 0.01839; @ qty: 1500; Minimum Quantity: 1; Power (Watts): 0.5W, 1/2W; Temperature Coefficient: ±200ppm/°C; Part Number: ERJ-P06J622V; Datasheets: https://industrial.panasonic.com/cdbs/www-data/pdf/RDA0000/AOA0000C243.pdf; Image: //media.digikey.com/Renders/Panasonic%20Renders/ERJ-0805%20Pkg.jpg; Digi-Key Part Number: P6.2KADCT-ND; Quantity Available: 14652; Packaging: Cut Tape (CT); Series: ERJ; Part Status: Active; Value: 6.2k; Tolerance: ±5%; Composition: Thick Film; Features: Automotive AEC-Q200, Pulse Withstanding; Operating Temperature: -55°C ~ 155°C; Package / Case: 0805 (2012 Metric); Supplier Device Package: 0805; Size / Dimension: 0.079" L x 0.049" W (2.00mm x 1.25mm); Height - Seated (Max): 0.028" (0.70mm); Number of Terminations: 2; Failure Rate: -
R61 = ERJ-P06J104V: RES SMD 100K OHM 5% 1/2W 0805; Manufacturer: Panasonic Electronic Components; Factory Stock: 0; Unit Price (USD): 0.01839; @ qty: 1500; Minimum Quantity: 1; Power (Watts): 0.5W, 1/2W; Temperature Coefficient: ±200ppm/°C; Part Number: ERJ-P06J104V; Datasheets: https://industrial.panasonic.com/cdbs/www-data/pdf/RDA0000/AOA0000C243.pdf; Image: //media.digikey.com/Renders/Panasonic%20Renders/ERJ-0805%20Pkg.jpg; Digi-Key Part Number: P100KADCT-ND; Quantity Available: 82264; Packaging: Cut Tape (CT); Series: ERJ; Part Status: Active; Value: 100k; Tolerance: ±5%; Composition: Thick Film; Features: Automotive AEC-Q200, Pulse Withstanding; Operating Temperature: -55°C ~ 155°C; Package / Case: 0805 (2012 Metric); Supplier Device Package: 0805; Size / Dimension: 0.079" L x 0.049" W (2.00mm x 1.25mm); Height - Seated (Max): 0.028" (0.70mm); Number of Terminations: 2; Failure Rate: -
R63 R64 = ERJ-P06J103V: as R68 on sheet connectors; Part Number: ERJ-P06J103V; Datasheets: https://industrial.panasonic.com/cdbs/www-data/pdf/RDA0000/AOA0000C243.pdf; Image: //media.digikey.com/Renders/Panasonic%20Renders/ERJ-0805%20Pkg.jpg; Digi-Key Part Number: P10KADCT-ND; Quantity Available: 413576; Packaging: Cut Tape (CT); Series: ERJ; Part Status: Active; Value: 10k; Tolerance: ±5%; Composition: Thick Film; Features: Automotive AEC-Q200, Pulse Withstanding; Operating Temperature: -55°C ~ 155°C; Package / Case: 0805 (2012 Metric); Supplier Device Package: 0805; Size / Dimension: 0.079" L x 0.049" W (2.00mm x 1.25mm); Height - Seated (Max): 0.028" (0.70mm); Number of Terminations: 2; Failure Rate: -
TP8-TP13 = TP: SMD TEST POINT
U8 = TL072CDR: as U8 on sheet beaglebone; Supplier 1: Digi-Key; Stock 1: 21821; Pricing 1: 1=0.41, 10=0.334, 100=0.2059, 500=0.1562, 1000=0.11715 (USD); Case/Package: D; Number of Pins: 8; Contact Plating: Gold; Min Operating Temperature: -40°C; Max Operating Temperature: 85°C; Package Quantity: 1; Packaging: Tape and Reel; Unity Gain Bandwidth Product: 3MHz; Bandwidth: 3MHz; Nominal Gain Bandwidth Product: 3MHz; Number of Circuits: 2; Gain Bandwidth Product: 3MHz; Input Offset Voltage (Vos): 10mV; Number of Elements: 2; Max Supply Voltage: 18V; Number of Amplifiers: 2; Length: 4.9mm; Height: 1.58mm; Width: 3.91mm; Radiation Hardening: No; Lead Free: Lead Free; REACH SVHC: No SVHC; ComponentLink1URL: http://www.ti.com/lit/ds/symlink/tl071a.pdf?src-supplier=Digi-Key; ComponentLink1Description: http://www.ti.com/lit/ds/symlink/tl071a.pdf?src-supplier=Digi-Key; ComponentLink2URL: http://www.ti.com/general/docs/lit/getliterature.tsp?genericPartNumber=TL072&&fileType=pdf&src-supplier=Avnet; ComponentLink2Description: http://www.ti.com/general/docs/lit/getliterature.tsp?genericPartNumber=TL072&&fileType=pdf&src-supplier=Avnet; ComponentLink3URL: http://www.farnell.com/datasheets/1882732.pdf?src-supplier=Element14; ComponentLink3Description: http://www.farnell.com/datasheets/1882732.pdf?src-supplier=Element14; Supplier Part Number 1: 296-1282-6-ND
U9 = INA240A3: IC AMP CURRENT SENSE 8-TSSOP 100V/V; Manufacturer: Texas Instruments; Number of Circuits: 1; Slew Rate: 2V/µs; -3db Bandwidth: 400kHz; Input Bias Current: 90uA; Input Offset Voltage (Vos): 5uV; Operating Supply Current: 1.8mA; Supplier 1: Digi-Key; Stock 1: 4680; Pricing 1: 1=2.65, 10=2.377, 25=2.2428, 100=1.7943, 250=1.56996, 500=1.52512, 1000=1.21113 (USD); Mount: Surface Mount; Case/Package: TSSOP; Number of Pins: 8; Min Operating Temperature: -40°C; Max Operating Temperature: 125°C; Packaging: Tape and Reel; ComponentLink1URL: http://www.ti.com/general/docs/lit/getliterature.tsp?genericPartNumber=INA240&fileType=pdf&src-supplier=Farnell; ComponentLink1Description: http://www.ti.com/general/docs/lit/getliterature.tsp?genericPartNumber=INA240&fileType=pdf&src-supplier=Farnell; ComponentLink2URL: http://www.ti.com/lit/ds/symlink/ina240.pdf?src-supplier=Digi-Key; ComponentLink2Description: http://www.ti.com/lit/ds/symlink/ina240.pdf?src-supplier=Digi-Key; Supplier Part Number 1: 296-45090-1-ND